# EAGLE design stepper_driver (EAGLE 9.0.1)
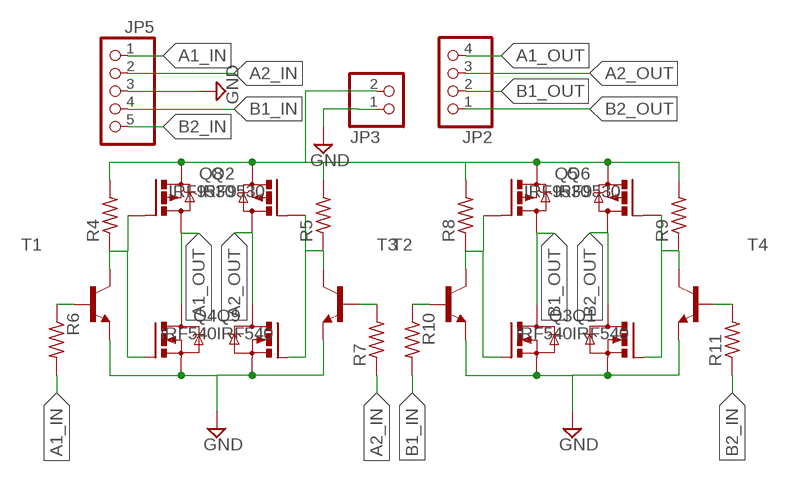
[diagram p0: schematic, sheet 1]

## Parts
JP2  PINHD-1X4/90  [1X04/90]
JP3  PINHD-1X2/90  [1X02/90]
JP5  PINHD-1X5/90  [1X05/90]
Q1  IRF540  [TO220BV]
Q2  IRF9530  [TO220BV]
Q3  IRF540  [TO220BV]
Q4  IRF540  [TO220BV]
Q5  IRF9530  [TO220BV]
Q6  IRF9530  [TO220BV]
Q8  IRF9530  [TO220BV]
Q9  IRF540  [TO220BV]
R4  R-US_0309/10  [0309/10]
R5  R-US_0309/10  [0309/10]
R6  R-US_0309/10  [0309/10]
R7  R-US_0309/10  [0309/10]
R8  R-US_0309/10  [0309/10]
R9  R-US_0309/10  [0309/10]
R10  R-US_0309/10  [0309/10]
R11  R-US_0309/10  [0309/10]
T1  2N2222-NPN-TO92-EBC  [TO92-EBC]
T2  2N2222-NPN-TO92-EBC  [TO92-EBC]
T3  2N2222-NPN-TO92-EBC  [TO92-EBC]
T4  2N2222-NPN-TO92-EBC  [TO92-EBC]

## Nets
A1_IN: JP5.1 R6.2
A1_OUT: JP2.4 Q8.D Q9.D
A2_IN: JP5.2 R7.1
A2_OUT: JP2.3 Q2.D Q4.D
B1_IN: JP5.4 R10.2
B1_OUT: JP2.2 Q1.D Q5.D
B2_IN: JP5.5 R11.1
B2_OUT: JP2.1 Q3.D Q6.D
GND: JP3.1 JP5.3 Q1.S Q3.S Q4.S Q9.S T1.E T2.E T3.E T4.E
N$2: JP3.2 Q2.S Q5.S Q6.S Q8.S R4.2 R5.2 R8.2 R9.2
N$4: Q2.G Q4.G R5.1 T2.C
N$8: R7.2 T2.B
N$9: Q1.G Q5.G R8.1 T3.C
N$10: Q3.G Q6.G R9.1 T4.C
N$11: Q8.G Q9.G R4.1 T1.C
N$12: R6.1 T1.B
N$13: R11.2 T4.B
N$14: R10.1 T3.B

## Library data of the parts
JP2 = pinhead:PINHD-1X4: PIN HEADER; SPICEPREFIX: E
JP3 = pinhead:PINHD-1X2: PIN HEADER
JP5 = pinhead:PINHD-1X5: PIN HEADER
Q1 Q3 Q4 Q9 = transistor-power:IRF540: HEXFET Power MOSFET
Q2 Q5 Q6 Q8 = transistor-power:IRF9530: P-CHANNEL HEXFET POWER-MOS-FET Source: http://www.irf.com/product-info/datasheets/data/irf9530.pdf
R4-R11 = rcl:R-US_: RESISTOR, American symbol; SPICEPREFIX: R
T1-T4 = transistor-neu-to92:*-NPN-: NPN Transistror

## Board
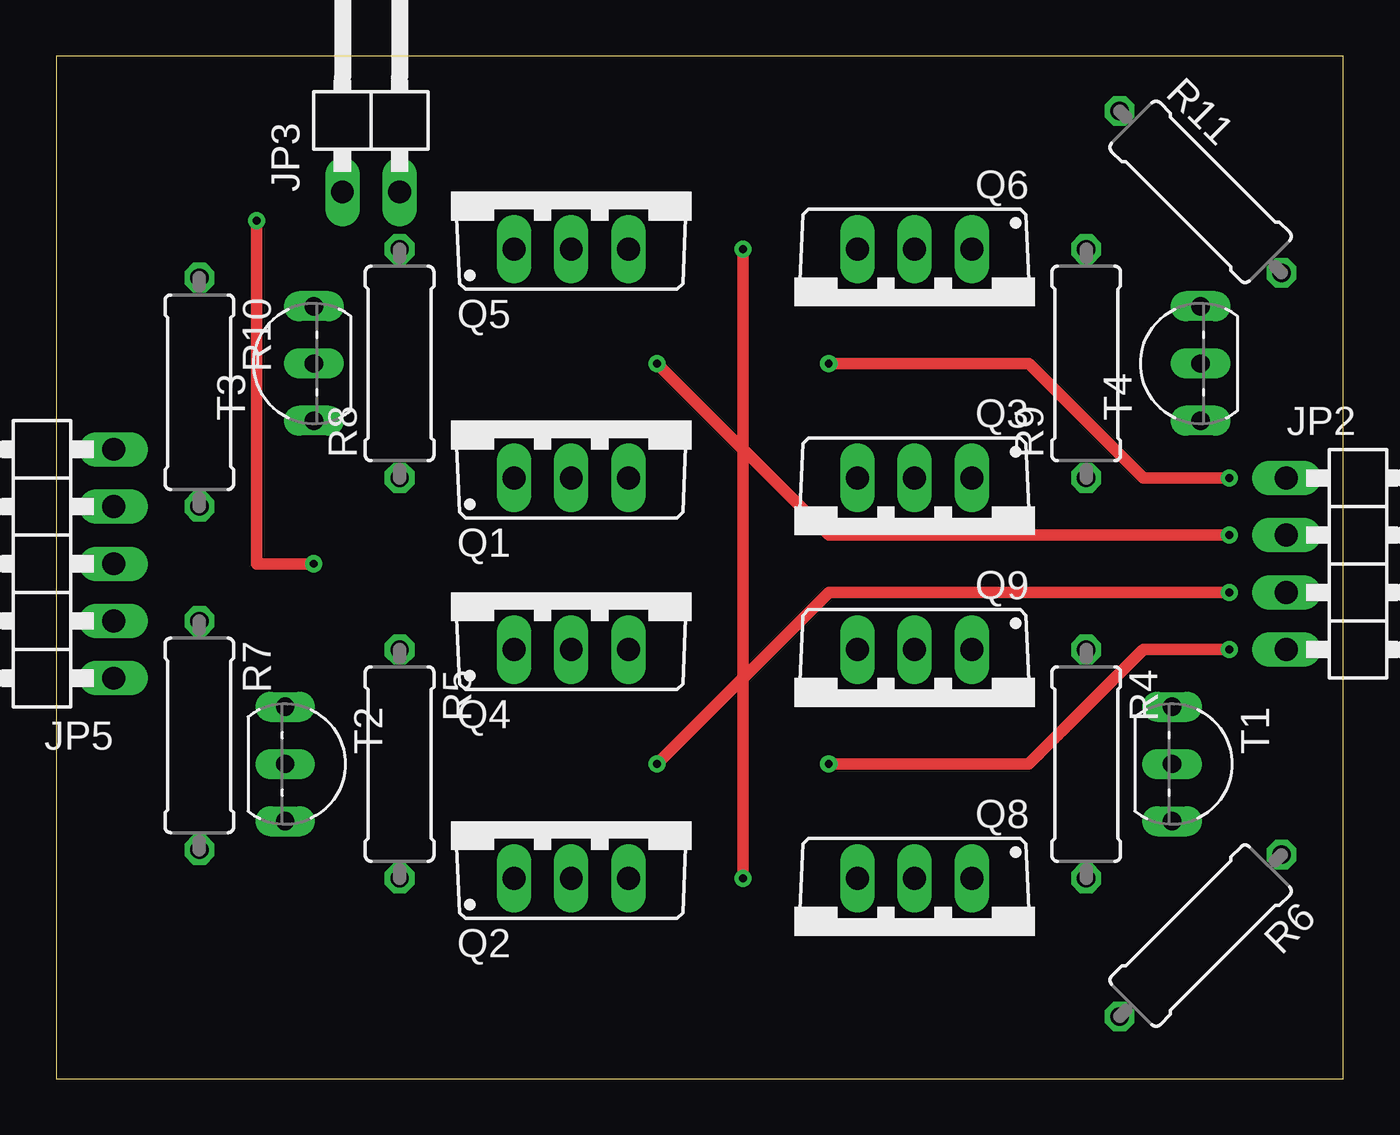
[diagram p1: board, top side]
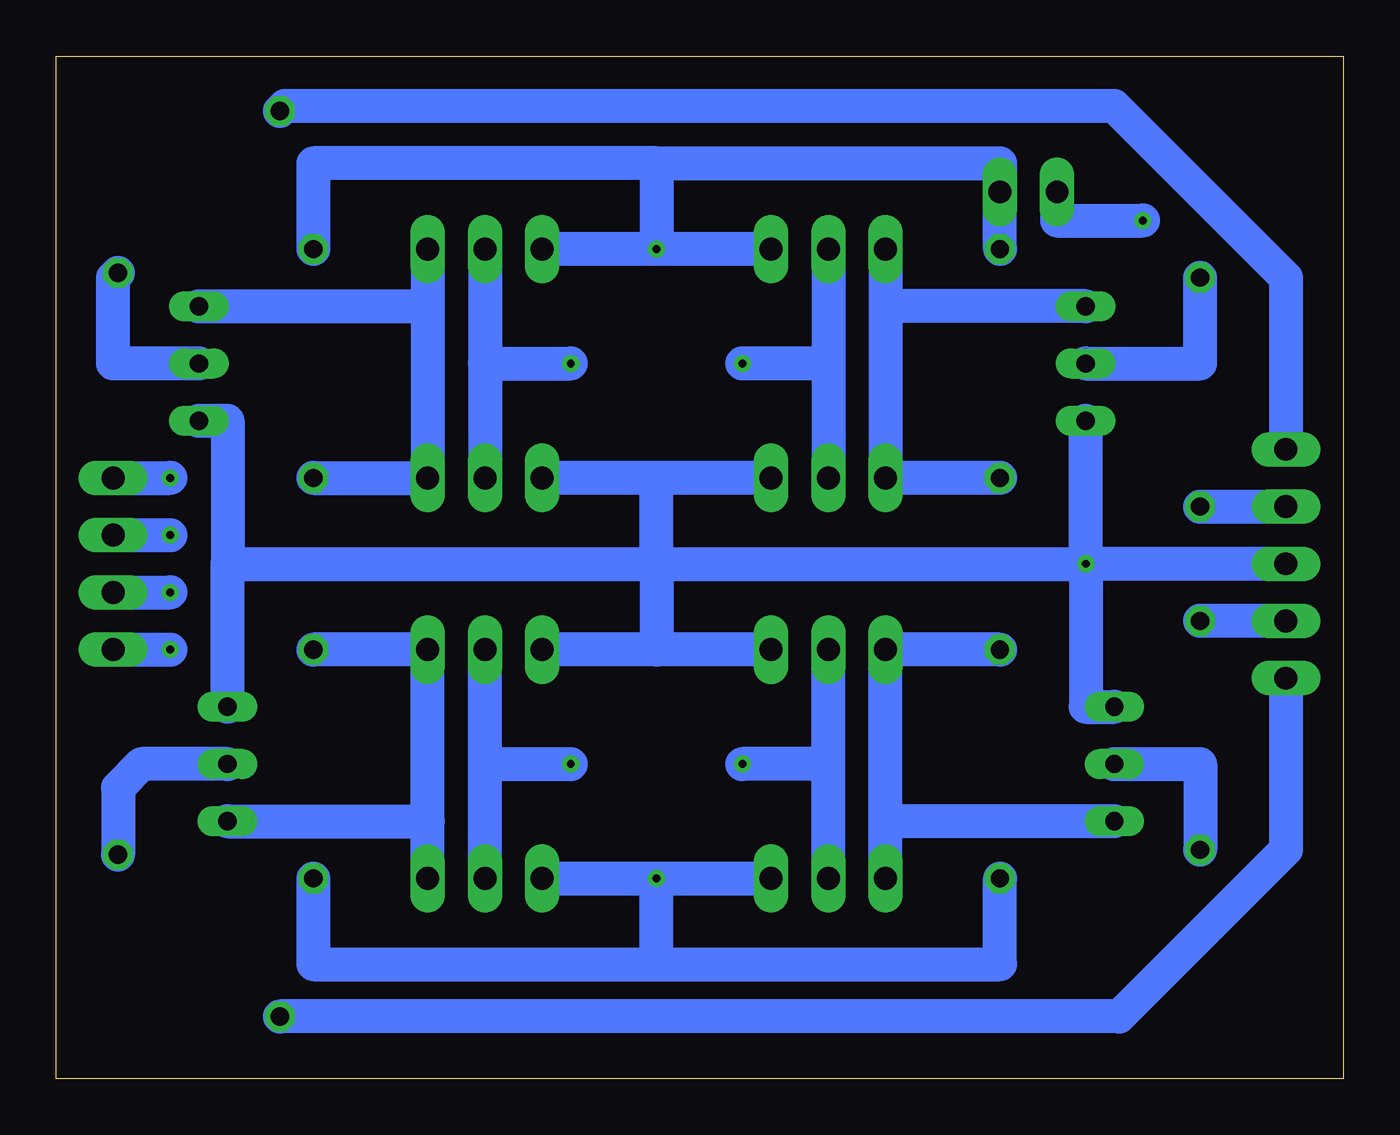
[diagram p2: board, bottom side, seen from below]

Size 57.13 x 45.39 mm. Coordinates in mm from the lower left corner, seen from the top.
Outline: 0,0 57.13,0 57.13,45.39 0,45.39 0,0
Copper layers (1*16): Top 0.035mm / dielectric 1.5mm / Bottom 0.035mm
Design rules "default": minimum track width 6mil, minimum drill 0.35mm, track to track 6mil, track to pad 6mil, pad to pad 6mil, via to via 6mil, smd to smd 6mil, copper to edge 40mil, drill to drill 6mil, minimum pad ring 10mil, minimum via ring 8mil, stop-mask expansion 4mil, vias tented up to drill 0mil, thermal gap 10mil

### Footprints (pad centres in the part's own frame; a part is rotated, then mirrored left to right if it is on the bottom)
1X04/90 = drill 1.016 long: 1 -3.81,-3.81; 2 -1.27,-3.81; 3 1.27,-3.81; 4 3.81,-3.81
1X02/90 = drill 1.016 long: 1 -1.27,-3.81; 2 1.27,-3.81
1X05/90 = drill 1.016 long: 1 -5.08,-3.81; 2 -2.54,-3.81; 3 0,-3.81; 4 2.54,-3.81; 5 5.08,-3.81
TO220BV = drill 1.016 long: D 0,-2.54; G -2.54,-2.54; S 2.54,-2.54
0309/10 = drill 0.813 octagon: 1 -5.08,0; 2 5.08,0
TO92-EBC = drill 0.813 long: B 0,-1.27; C 2.54,-1.27; E -2.54,-1.27

### Placement (x,y rotation side)
JP2  58.42,22.86 270 top
JP3  13.97,43.18 0 top
JP5  -1.27,22.86 90 top
Q1  22.86,29.21 0 top
Q2  22.86,11.43 0 top
Q3  38.1,24.13 180 top
Q4  22.86,21.59 0 top
Q5  22.86,39.37 0 top
Q6  38.1,34.29 180 top
Q8  38.1,6.35 180 top
Q9  38.1,16.51 180 top
R4  45.72,13.97 270 top
R5  15.24,13.97 270 top
R6  50.8,6.35 225 top
R7  6.35,15.24 270 top
R8  15.24,31.75 90 top
R9  45.72,31.75 90 top
R10  6.35,30.48 270 top
R11  50.8,39.37 315 top
T1  50.8,13.97 270 top
T2  11.43,13.97 270 top
T3  10.16,31.75 90 top
T4  49.53,31.75 90 top

### Tracks (layer width: path | path; a pad name or v marks a point on that pad's centre or on a via)
A1_IN
  Bottom 1.5: JP5.1 2.54,10.16 9.94,2.76 R6.2
A1_OUT  (via drill 0.35)
  Top 0.5: v52.07,19.05 48.26,19.05 43.18,13.97 v34.29,13.97
  Bottom 1.5: Q8.D 38.1,13.97 | 38.1,13.97 Q9.D | JP2.4 v52.07,19.05 | 38.1,13.97 v34.29,13.97
A2_IN
  Bottom 1.5: JP5.2 R7.1
A2_OUT  (via drill 0.35)
  Top 0.5: v52.07,21.59 34.29,21.59 v26.67,13.97
  Bottom 1.5: Q2.D 22.86,13.97 | 22.86,13.97 Q4.D | JP2.3 v52.07,21.59 | 22.86,13.97 v26.67,13.97
B1_IN
  Bottom 1.5: R10.2 JP5.4
B1_OUT  (via drill 0.35)
  Top 0.5: v52.07,24.13 34.29,24.13 v26.67,31.75
  Bottom 1.5: Q5.D 22.86,31.75 | 22.86,31.75 Q1.D | JP2.2 v52.07,24.13 | 22.86,31.75 v26.67,31.75
B2_IN
  Bottom 1.5: JP5.5 2.54,35.56 10.16,43.18 46.99,43.18 R11.1
B2_OUT  (via drill 0.35)
  Top 0.5: v52.07,26.67 48.26,26.67 43.18,31.75 v34.29,31.75
  Bottom 1.5: Q6.D 38.1,31.75 | 38.1,31.75 Q3.D | JP2.1 v52.07,26.67 | 38.1,31.75 v34.29,31.75
GND  (via drill 0.35)
  Top 0.5: v8.89,38.1 8.89,22.86 v11.43,22.86
  Bottom 1.5: Q4.S 30.48,19.05 | 30.48,19.05 Q9.S | T1.E 49.53,22.86 | 49.53,22.86 30.48,22.86 | 30.48,22.86 30.48,19.05 | Q1.S 30.48,26.67 | 30.48,26.67 Q3.S | 30.48,22.86 30.48,26.67 | T4.E 49.53,29.21 49.53,22.86 | 30.48,22.86 v11.43,22.86 | v11.43,22.86 T3.E | v11.43,22.86 11.43,16.51 T2.E | JP5.3 v11.43,22.86 | JP3.1 12.7,38.1 v8.89,38.1
N$2  (via drill 0.35)
  Top 0.5: v30.48,36.83 v30.48,8.89
  Bottom 1.5: Q8.S v30.48,8.89 | v30.48,8.89 Q2.S | R4.2 45.72,5.08 30.48,5.08 | 30.48,5.08 15.24,5.08 R5.2 | 30.48,5.08 v30.48,8.89 | Q5.S v30.48,36.83 | v30.48,36.83 Q6.S | R8.2 JP3.2 15.24,40.64 30.48,40.64 | 30.48,40.64 45.72,40.64 R9.2 | 30.48,40.64 v30.48,36.83
N$4
  Bottom 1.5: Q2.G 20.32,11.43 | 20.32,11.43 Q4.G R5.1 | T2.C 20.32,11.43
N$8
  Bottom 1.5: T2.B 6.35,13.97 R7.2
N$9
  Bottom 1.5: Q5.G 20.32,34.29 | 20.32,34.29 Q1.G R8.1 | T3.C 20.32,34.29
N$10
  Bottom 1.5: Q6.G 40.64,34.29 | 40.64,34.29 Q3.G R9.1 | T4.C 40.64,34.29
N$11
  Bottom 1.5: Q8.G 40.64,11.43 | 40.64,11.43 Q9.G R4.1 | T1.C 40.64,11.43
N$12
  Bottom 1.5: T1.B 53.34,13.97 54.39,12.92 R6.1
N$13
  Bottom 1.5: T4.B 54.61,31.75 54.61,35.56 | 54.61,35.56 | 54.61,35.56 R11.2
N$14
  Bottom 1.5: T3.B 6.35,31.75 R10.1